# EAGLE schematic functional (EAGLE 7.3.0)
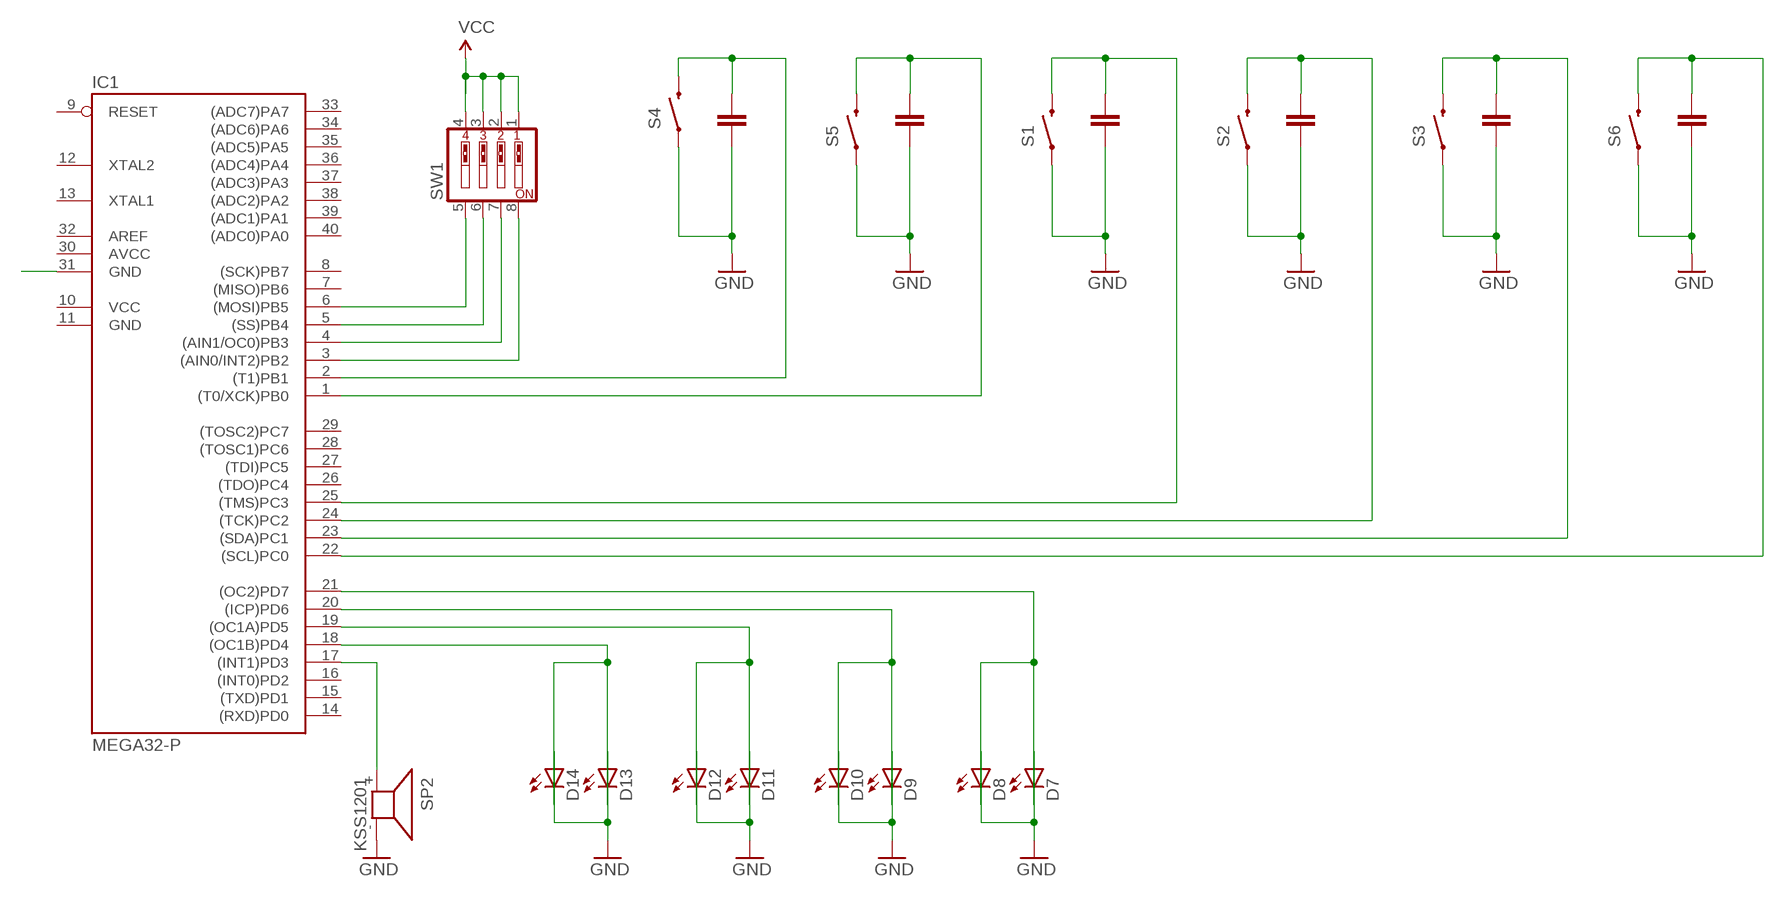
[diagram p0: schematic, sheet 1]

## Parts
D7  LED5MM  [LED5MM]
D8  LED5MM  [LED5MM]
D9  LED5MM  [LED5MM]
D10  LED5MM  [LED5MM]
D11  LED5MM  [LED5MM]
D12  LED5MM  [LED5MM]
D13  LED5MM  [LED5MM]
D14  LED5MM  [LED5MM]
IC1  MEGA32-P  [DIL40]
S1  SWITCH-MOMENTARY-2PTH  [TACTILE-PTH]
S2  SWITCH-MOMENTARY-2PTH  [TACTILE-PTH]
S3  SWITCH-MOMENTARY-2PTH  [TACTILE-PTH]
S4  SWITCH-MOMENTARY-2PTH  [TACTILE-PTH]
S5  SWITCH-MOMENTARY-2PTH  [TACTILE-PTH]
S6  SWITCH-MOMENTARY-2PTH  [TACTILE-PTH]
SP2  KSS1201  [KSS1201]
SW1  SW_DIP-4  [EDG-04]

## Nets
GND: D7.A D8.A D9.A D10.A D11.A D12.A D13.A D14.A S1.1 S2.1 S3.1 S4.1 S5.1 S6.1 SP2.-
N$1: IC1.25((TMS)PC3) S1.3
N$2: IC1.24((TCK)PC2) S2.3
N$3: IC1.23((SDA)PC1) S3.3
N$5: IC1.22((SCL)PC0) S6.3
N$8: D7.K(C) D8.K(C) IC1.21((OC2)PD7)
N$10: IC1.2((T1)PB1) S4.3
N$14: IC1.3((AIN0/INT2)PB2) SW1.8
N$15: D9.K(C) D10.K(C) IC1.20((ICP)PD6)
N$18: IC1.4((AIN1/OC0)PB3) SW1.7
N$19: D11.K(C) D12.K(C) IC1.19((OC1A)PD5)
N$22: IC1.5((SS)PB4) SW1.6
N$23: D13.K(C) D14.K(C) IC1.18((OC1B)PD4)
N$26: IC1.6((MOSI)PB5) SW1.5
N$27: IC1.31(GND)
N$31: IC1.1((T0/XCK)PB0) S5.3
N$33: IC1.17((INT1)PD3) SP2.+
VCC: SW1.1 SW1.2 SW1.3 SW1.4
Unconnected: IC1.7((MISO)PB6) IC1.8((SCK)PB7) IC1.9(RESET) IC1.12(XTAL2) IC1.13(XTAL1) IC1.14((RXD)PD0) IC1.15((TXD)PD1) IC1.16((INT0)PD2) IC1.26((TDO)PC4) IC1.27((TDI)PC5) IC1.28((TOSC1)PC6) IC1.29((TOSC2)PC7) IC1.32(AREF) IC1.33((ADC7)PA7) IC1.34((ADC6)PA6) IC1.35((ADC5)PA5) IC1.36((ADC4)PA4) IC1.37((ADC3)PA3) IC1.38((ADC2)PA2) IC1.39((ADC1)PA1) IC1.40((ADC0)PA0)

## Power pins joined to a net without a drawn wire
AVCC: IC1.30(AVCC)
GND: IC1.11(GND)
VCC: IC1.10(VCC)

## Library data of the parts
D7-D14 = SparkFun-LED:LED: LEDs Standard schematic elements and footprints for 5mm, 3mm, 1206, and 0603 sized LEDs. 5mm - Spark Fun Electronics SKU : COM-00529 (and others)
IC1 = atmel:MEGA32-P: MICROCONTROLLER 32 Kbytes FLASH 2 Kbytes SRAM 1 Kbytes EEPROM USART 8-channel 10 bit ADC Source: www.atmel.com .. doc2503.pdf; MPN: ATMEGA32-16PU; OC_FARNELL: 1661729; OC_NEWARK: 51P1794
S1-S6 = SparkFun-Electromechanical:SWITCH-MOMENTARY-2: Various NO switches- pushbuttons, reed, etc; PROD_ID: SWCH-08441
SP2 = buzzer:KSS1201: SPEAKER Source: Schukat; OC_FARNELL: unknown; OC_NEWARK: unknown
SW1 = special:SW_DIP-4: DIP SWITCH